# EAGLE schematic breakout (EAGLE 7.4.0)
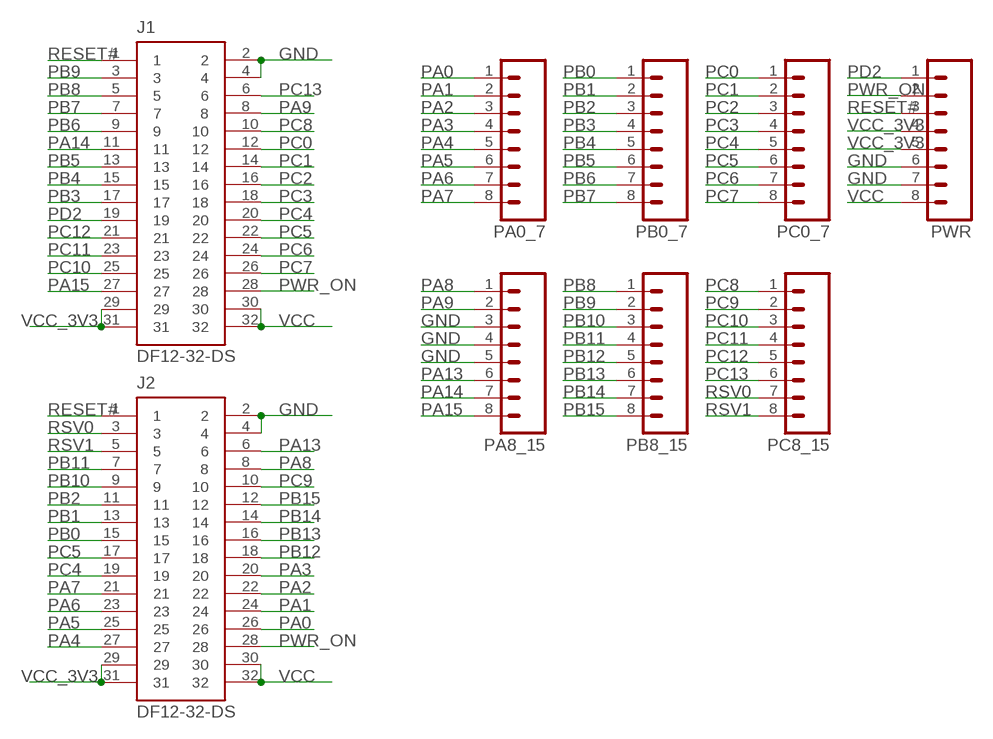
[diagram p0: schematic, sheet 1]

## Parts
J1  DF12-32-DS  AS-ITM-00012  [DF12-32-DS]
J2  DF12-32-DS  AS-ITM-00012  [DF12-32-DS]
PA0_7  M08FEMALE_LOCK  [1X08_FEMALE_LOCK]
PA8_15  M08FEMALE_LOCK  [1X08_FEMALE_LOCK]
PB0_7  M08FEMALE_LOCK  [1X08_FEMALE_LOCK]
PB8_15  M08FEMALE_LOCK  [1X08_FEMALE_LOCK]
PC0_7  M08FEMALE_LOCK  [1X08_FEMALE_LOCK]
PC8_15  M08FEMALE_LOCK  [1X08_FEMALE_LOCK]
PWR  M08FEMALE_LOCK  [1X08_FEMALE_LOCK]

## Nets
GND: J1.2 J1.4 J2.2 J2.4 PA8_15.3 PA8_15.4 PA8_15.5 PWR.6 PWR.7
PA0: J2.26 PA0_7.1
PA1: J2.24 PA0_7.2
PA2: J2.22 PA0_7.3
PA3: J2.20 PA0_7.4
PA4: J2.27 PA0_7.5
PA5: J2.25 PA0_7.6
PA6: J2.23 PA0_7.7
PA7: J2.21 PA0_7.8
PA8: J2.8 PA8_15.1
PA9: J1.8 PA8_15.2
PA13: J2.6 PA8_15.6
PA14: J1.11 PA8_15.7
PA15: J1.27 PA8_15.8
PB0: J2.15 PB0_7.1
PB1: J2.13 PB0_7.2
PB2: J2.11 PB0_7.3
PB3: J1.17 PB0_7.4
PB4: J1.15 PB0_7.5
PB5: J1.13 PB0_7.6
PB6: J1.9 PB0_7.7
PB7: J1.7 PB0_7.8
PB8: J1.5 PB8_15.1
PB9: J1.3 PB8_15.2
PB10: J2.9 PB8_15.3
PB11: J2.7 PB8_15.4
PB12: J2.18 PB8_15.5
PB13: J2.16 PB8_15.6
PB14: J2.14 PB8_15.7
PB15: J2.12 PB8_15.8
PC0: J1.12 PC0_7.1
PC1: J1.14 PC0_7.2
PC2: J1.16 PC0_7.3
PC3: J1.18 PC0_7.4
PC4: J1.20 J2.19 PC0_7.5
PC5: J1.22 J2.17 PC0_7.6
PC6: J1.24 PC0_7.7
PC7: J1.26 PC0_7.8
PC8: J1.10 PC8_15.1
PC9: J2.10 PC8_15.2
PC10: J1.25 PC8_15.3
PC11: J1.23 PC8_15.4
PC12: J1.21 PC8_15.5
PC13: J1.6 PC8_15.6
PD2: J1.19 PWR.1
PWR_ON: J1.28 J2.28 PWR.2
RESET#: J1.1 J2.1 PWR.3
RSV0: J2.3 PC8_15.7
RSV1: J2.5 PC8_15.8
VCC: J1.30 J1.32 J2.30 J2.32 PWR.8
VCC_3V3: J1.29 J1.31 J2.29 J2.31 PWR.4 PWR.5

## Library data of the parts
J1 J2 = micro1292:AS-ITM-00012: CONN RECEPT 32POS 3MM SMD 0.5MM; PARTNO: AS-ITM-00012
PA0_7 PA8_15 PB0_7 PB8_15 PC0_7 PC8_15 PWR = SparkFun-Connectors:M08: Header 8 Standard 8-pin 0.1" header. Use with straight break away headers (SKU : PRT-00116), right angle break away headers (PRT-00553), swiss pins (PRT-00743), machine pins (PRT-00117), and female headers (PRT-00115).